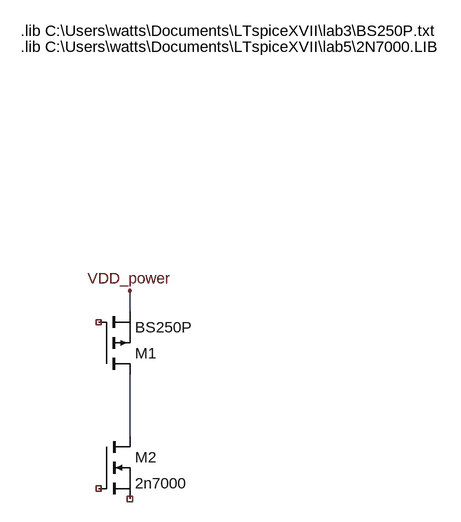
[diagram p0: schematic CMOS_3AND.asc]
CMOS_3AND.asc, the LTspice schematic file:
Version 4
SHEET 1 1272 680
WIRE 272 -96 272 -128
WIRE 272 96 272 0
FLAG 272 -128 VDD_power
SYMBOL nmos 224 96 R0
SYMATTR InstName M2
SYMATTR Value 2n7000
SYMATTR Prefix X
SYMBOL pmos 224 0 M180
SYMATTR InstName M1
SYMATTR Value BS250P
SYMATTR Prefix X
TEXT 104 -504 Left 2 !.lib C:\\Users\\watts\\Documents\\LTspiceXVII\\lab5\\2N7000.LIB
TEXT 104 -528 Left 2 !.lib C:\\Users\\watts\\Documents\\LTspiceXVII\\lab3\\BS250P.txt

The netlist it stands for:
* CMOS_3AND.asc
XM2 N001 NC_01 NC_02 2n7000  ; pins D G S
XM1 N001 NC_03 VDD_power BS250P  ; pins D G S
.lib C:\Users\watts\Documents\LTspiceXVII\lab5\2N7000.LIB
.lib C:\Users\watts\Documents\LTspiceXVII\lab3\BS250P.txt
.backanno
.end